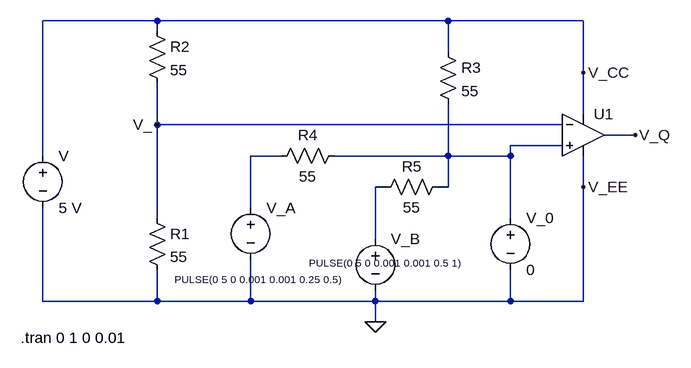
[diagram p0: schematic assig2_q4.asc]
assig2_q4.asc, the LTspice schematic file:
Version 4
SHEET 1 880 680
WIRE -176 -128 -352 -128
WIRE 272 -128 -176 -128
WIRE 480 -128 272 -128
WIRE -176 -112 -176 -128
WIRE 272 -80 272 -128
WIRE 480 -48 480 -128
WIRE 480 16 480 -48
WIRE -176 32 -176 -32
WIRE 448 32 -176 32
WIRE 560 48 512 48
WIRE 448 64 368 64
WIRE -352 80 -352 -128
WIRE 16 80 -32 80
WIRE 272 80 272 0
WIRE 272 80 96 80
WIRE 368 80 368 64
WIRE 368 80 272 80
WIRE 176 128 160 128
WIRE 272 128 272 80
WIRE 272 128 256 128
WIRE 480 128 480 80
WIRE -32 160 -32 80
WIRE -176 176 -176 32
WIRE 368 176 368 80
WIRE 160 208 160 128
WIRE -352 304 -352 160
WIRE -176 304 -176 256
WIRE -176 304 -352 304
WIRE -32 304 -32 240
WIRE -32 304 -176 304
WIRE 160 304 160 288
WIRE 160 304 -32 304
WIRE 368 304 368 256
WIRE 368 304 160 304
WIRE 480 304 480 128
WIRE 480 304 368 304
WIRE 160 336 160 304
FLAG 160 336 0
FLAG 480 128 V_EE
FLAG 480 -48 V_CC
FLAG 560 48 V_Q
FLAG -176 32 V_
SYMBOL res -192 160 R0
SYMATTR InstName R1
SYMATTR Value 55
SYMBOL res -192 -128 R0
SYMATTR InstName R2
SYMATTR Value 55
SYMBOL voltage -352 64 R0
SYMATTR InstName V
SYMATTR Value 5 V
SYMBOL OpAmps\\UniversalOpamp2 480 48 R0
SYMATTR InstName U1
SYMBOL voltage 160 192 R0
WINDOW 123 0 0 Left 0
WINDOW 39 0 0 Left 0
WINDOW 3 127 53 Right 1
SYMATTR InstName V_B
SYMATTR Value PULSE(0 5 0 0.001 0.001 0.5 1)
SYMBOL res 256 -96 R0
SYMATTR InstName R3
SYMATTR Value 55
SYMBOL res 112 64 R90
WINDOW 0 0 56 VBottom 2
WINDOW 3 32 56 VTop 2
SYMATTR InstName R4
SYMATTR Value 55
SYMBOL res 272 112 R90
WINDOW 0 0 56 VBottom 2
WINDOW 3 32 56 VTop 2
SYMATTR InstName R5
SYMATTR Value 55
SYMBOL voltage -32 144 R0
WINDOW 3 135 126 Right 1
WINDOW 123 0 0 Left 0
WINDOW 39 0 0 Left 0
SYMATTR InstName V_A
SYMATTR Value PULSE(0 5 0 0.001 0.001 0.25 0.5)
SYMBOL voltage 368 160 R0
SYMATTR InstName V_0
SYMATTR Value 0
TEXT -386 360 Left 2 !.tran 0 1 0 0.01

The netlist it stands for:
* assig2_q4.asc
R1 V_ 0 55
R2 V_CC V_ 55
V V_CC 0 5 V
XU1 N001 V_ V_CC 0 V_Q level.2 Avol=1Meg GBW=10Meg Slew=10Meg ilimit=25m rail=0 Vos=0 phimargin=45 en=0 enk=0 in=0 ink=0 Rin=500Meg  ; pins IN+ IN- V+ V- OUT
V_B N003 0 PULSE(0 5 0 0.001 0.001 0.5 1)
R3 V_CC N001 55
R4 N001 N002 55
R5 N001 N003 55
V_A N002 0 PULSE(0 5 0 0.001 0.001 0.25 0.5)
V_0 N001 0 0
.tran 0 1 0 0.01
.lib UniversalOpamps2.sub
.backanno
.end